# Altium schematic sheet smartGarden_Mcu_Rev01.SchDoc
size A
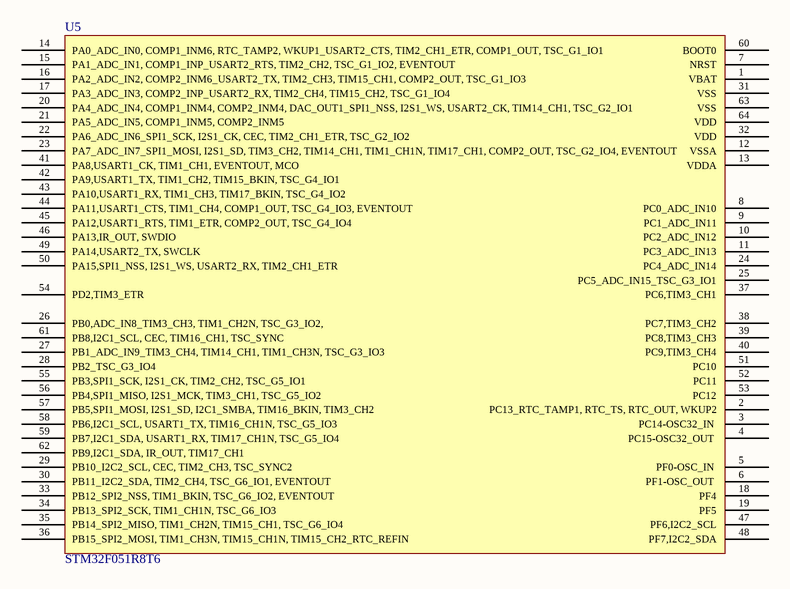
[diagram p0: smartGarden_Mcu_Rev01.SchDoc]

## Parts
U5  STM32F051R8T6  [LQFP64]

## Nets

Not connected (* = marked no-connect by the designer): U5 1(VBAT) 2(PC13_RTC_TAMP1,_RTC_TS,_RTC_OUT,_WKUP2) 3(PC14-OSC32_IN_) 4(PC15-OSC32_OUT_) 5(PF0-OSC_IN_) 6(PF1-OSC_OUT_) 7(NRST) 8(PC0_ADC_IN10) 9(PC1_ADC_IN11) 10(PC2_ADC_IN12) 11(PC3_ADC_IN13) 12(VSSA) 13(VDDA) 14(PA0_ADC_IN0,_COMP1_INM6,_RTC_TAMP2,_WKUP1_USART2_CTS,_TIM2_CH1_ETR,_COMP1_OUT,_TSC_G1_IO1) 15(PA1_ADC_IN1,_COMP1_INP_USART2_RTS,_TIM2_CH2,_TSC_G1_IO2,_EVENTOUT) 16(PA2_ADC_IN2,_COMP2_INM6_USART2_TX,_TIM2_CH3,_TIM15_CH1,_COMP2_OUT,_TSC_G1_IO3) 17(PA3_ADC_IN3,_COMP2_INP_USART2_RX,_TIM2_CH4,_TIM15_CH2,_TSC_G1_IO4) 18(PF4) 19(PF5) 20(PA4_ADC_IN4,_COMP1_INM4,_COMP2_INM4,_DAC_OUT1_SPI1_NSS,_I2S1_WS,_USART2_CK,_TIM14_CH1,_TSC_G2_IO1) 21(PA5_ADC_IN5,_COMP1_INM5,_COMP2_INM5) 22(PA6_ADC_IN6_SPI1_SCK,_I2S1_CK,_CEC,_TIM2_CH1_ETR,_TSC_G2_IO2) 23(PA7_ADC_IN7_SPI1_MOSI,_I2S1_SD,_TIM3_CH2,_TIM14_CH1,_TIM1_CH1N,_TIM17_CH1,_COMP2_OUT,_TSC_G2_IO4,_EVENTOUT) 24(PC4_ADC_IN14) 25(PC5_ADC_IN15_TSC_G3_IO1) 26(PB0,ADC_IN8_TIM3_CH3,_TIM1_CH2N,_TSC_G3_IO2,_) 27(PB1_ADC_IN9_TIM3_CH4,_TIM14_CH1,_TIM1_CH3N,_TSC_G3_IO3) 28(PB2_TSC_G3_IO4) 29(PB10_I2C2_SCL,_CEC,_TIM2_CH3,_TSC_SYNC2) 30(PB11_I2C2_SDA,_TIM2_CH4,_TSC_G6_IO1,_EVENTOUT) 31(VSS) 32(VDD) 33(PB12_SPI2_NSS,_TIM1_BKIN,_TSC_G6_IO2,_EVENTOUT) 34(PB13_SPI2_SCK,_TIM1_CH1N,_TSC_G6_IO3) 35(PB14_SPI2_MISO,_TIM1_CH2N,_TIM15_CH1,_TSC_G6_IO4) 36(PB15_SPI2_MOSI,_TIM1_CH3N,_TIM15_CH1N,_TIM15_CH2_RTC_REFIN) 37(PC6,TIM3_CH1) 38(PC7,TIM3_CH2) 39(PC8,TIM3_CH3) 40(PC9,TIM3_CH4) 41(PA8,USART1_CK,_TIM1_CH1,_EVENTOUT,_MCO) 42(PA9,USART1_TX,_TIM1_CH2,_TIM15_BKIN,_TSC_G4_IO1) 43(PA10,USART1_RX,_TIM1_CH3,_TIM17_BKIN,_TSC_G4_IO2) 44(PA11,USART1_CTS,_TIM1_CH4,_COMP1_OUT,_TSC_G4_IO3,_EVENTOUT) 45(PA12,USART1_RTS,_TIM1_ETR,_COMP2_OUT,_TSC_G4_IO4) 46(PA13,IR_OUT,_SWDIO) 47(PF6,I2C2_SCL) 48(PF7,I2C2_SDA) 49(PA14,USART2_TX,_SWCLK) 50(PA15,SPI1_NSS,_I2S1_WS,_USART2_RX,_TIM2_CH1_ETR) 51(PC10) 52(PC11) 53(PC12) 54(PD2,TIM3_ETR) 55(PB3,SPI1_SCK,_I2S1_CK,_TIM2_CH2,_TSC_G5_IO1) 56(PB4,SPI1_MISO,_I2S1_MCK,_TIM3_CH1,_TSC_G5_IO2) 57(PB5,SPI1_MOSI,_I2S1_SD,_I2C1_SMBA,_TIM16_BKIN,_TIM3_CH2) 58(PB6,I2C1_SCL,_USART1_TX,_TIM16_CH1N,_TSC_G5_IO3) 59(PB7,I2C1_SDA,_USART1_RX,_TIM17_CH1N,_TSC_G5_IO4) 60(BOOT0) 61(PB8,I2C1_SCL,_CEC,_TIM16_CH1,_TSC_SYNC) 62(PB9,I2C1_SDA,_IR_OUT,_TIM17_CH1) 63(VSS) 64(VDD)